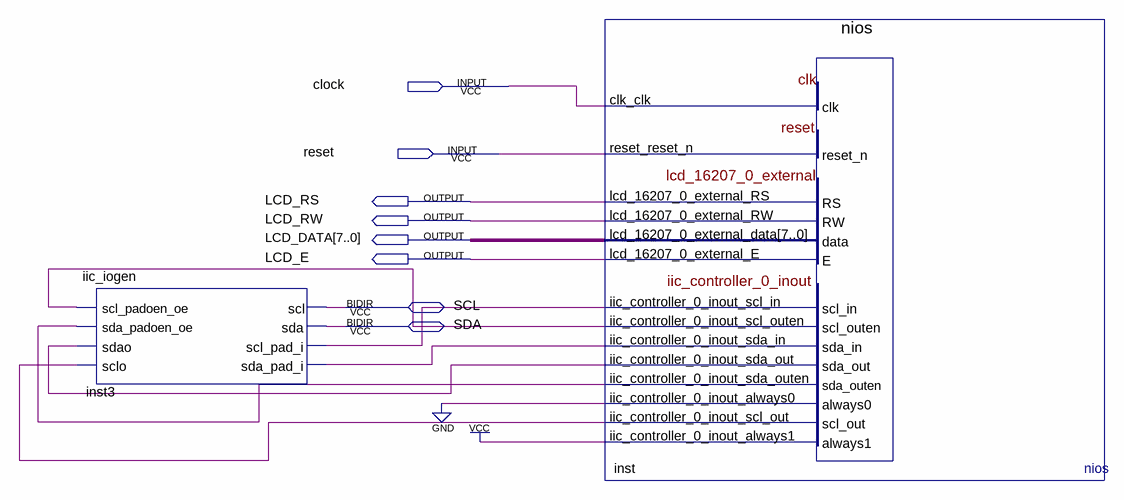
[diagram p0: schematic sheet]
// Quartus schematic imu.bdf as structural Verilog: 2 symbols, 8 pins
module imu (
  input  clock,
  input  reset,
  inout  SCL,
  inout  SDA,
  output LCD_RS,
  output LCD_RW,
  output [7:0] LCD_DATA,
  output LCD_E
);

  wire inst3_scl_pad_i, inst3_sda_pad_i, inst_iic_controller_0_inout_scl_out,
       inst_iic_controller_0_inout_scl_outen, inst_iic_controller_0_inout_sda_out,
       inst_iic_controller_0_inout_sda_outen;

  iic_iogen inst3 (
    .scl_padoen_oe(inst_iic_controller_0_inout_scl_outen),
    .sda_padoen_oe(inst_iic_controller_0_inout_sda_outen), .sdao(inst_iic_controller_0_inout_sda_out),
    .sclo(inst_iic_controller_0_inout_scl_out), .scl(SCL), .scl_pad_i(inst3_scl_pad_i),
    .sda_pad_i(inst3_sda_pad_i), .sda(SDA));
  nios inst (
    .clk_clk(clock), .reset_reset_n(reset), .iic_controller_0_inout_scl_in(inst3_scl_pad_i),
    .iic_controller_0_inout_sda_in(inst3_sda_pad_i), .iic_controller_0_inout_always0(1'b0),
    .iic_controller_0_inout_always1(1'b1), .lcd_16207_0_external_RS(LCD_RS),
    .lcd_16207_0_external_RW(LCD_RW), .lcd_16207_0_external_E(LCD_E),
    .iic_controller_0_inout_scl_outen(inst_iic_controller_0_inout_scl_outen),
    .iic_controller_0_inout_sda_out(inst_iic_controller_0_inout_sda_out),
    .iic_controller_0_inout_sda_outen(inst_iic_controller_0_inout_sda_outen),
    .iic_controller_0_inout_scl_out(inst_iic_controller_0_inout_scl_out), .lcd_16207_0_external_data(LCD_DATA));
endmodule
